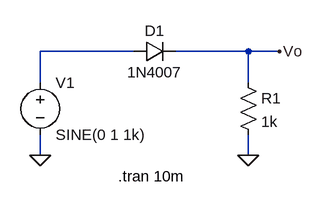
[diagram p0: schematic Draft2_rectifier.asc]
Draft2_rectifier.asc, the LTspice schematic file:
Version 4
SHEET 1 880 680
WIRE 160 112 16 112
WIRE 336 112 224 112
WIRE 384 112 336 112
WIRE 16 160 16 112
WIRE 336 160 336 112
WIRE 16 272 16 240
WIRE 336 272 336 240
FLAG 16 272 0
FLAG 336 272 0
FLAG 384 112 Vo
SYMBOL diode 160 128 R270
WINDOW 0 32 32 VTop 2
WINDOW 3 0 32 VBottom 2
SYMATTR InstName D1
SYMATTR Value 1N4007
SYMBOL voltage 16 144 R0
WINDOW 123 0 0 Left 0
WINDOW 39 0 0 Left 0
SYMATTR InstName V1
SYMATTR Value SINE(0 1 1k)
SYMBOL res 320 144 R0
SYMATTR InstName R1
SYMATTR Value 1k
TEXT 136 304 Left 2 !.tran 10m

The netlist it stands for:
* Draft2_rectifier.asc
D1 N001 Vo 1N4007
V1 N001 0 SINE(0 1 1k)
R1 Vo 0 1k
.model D D
.lib standard.dio
.tran 10m
.backanno
.end